# Altium schematic sheet mixer-rx.SchDoc: RX Mixer
size Letter; CheckedBy: J. Brinton; CompanyName: Signal Laboratories, Inc.; DrawnBy: J. Brinton; Engineer: J. Brinton; Address1: 3479 Edison Way; Address2: Menlo Park CA 94025; Address3: +1 (877) 778-8435; Address4: siglabs.com; Revision: 3; SheetNumber: 13; SheetTotal: 49
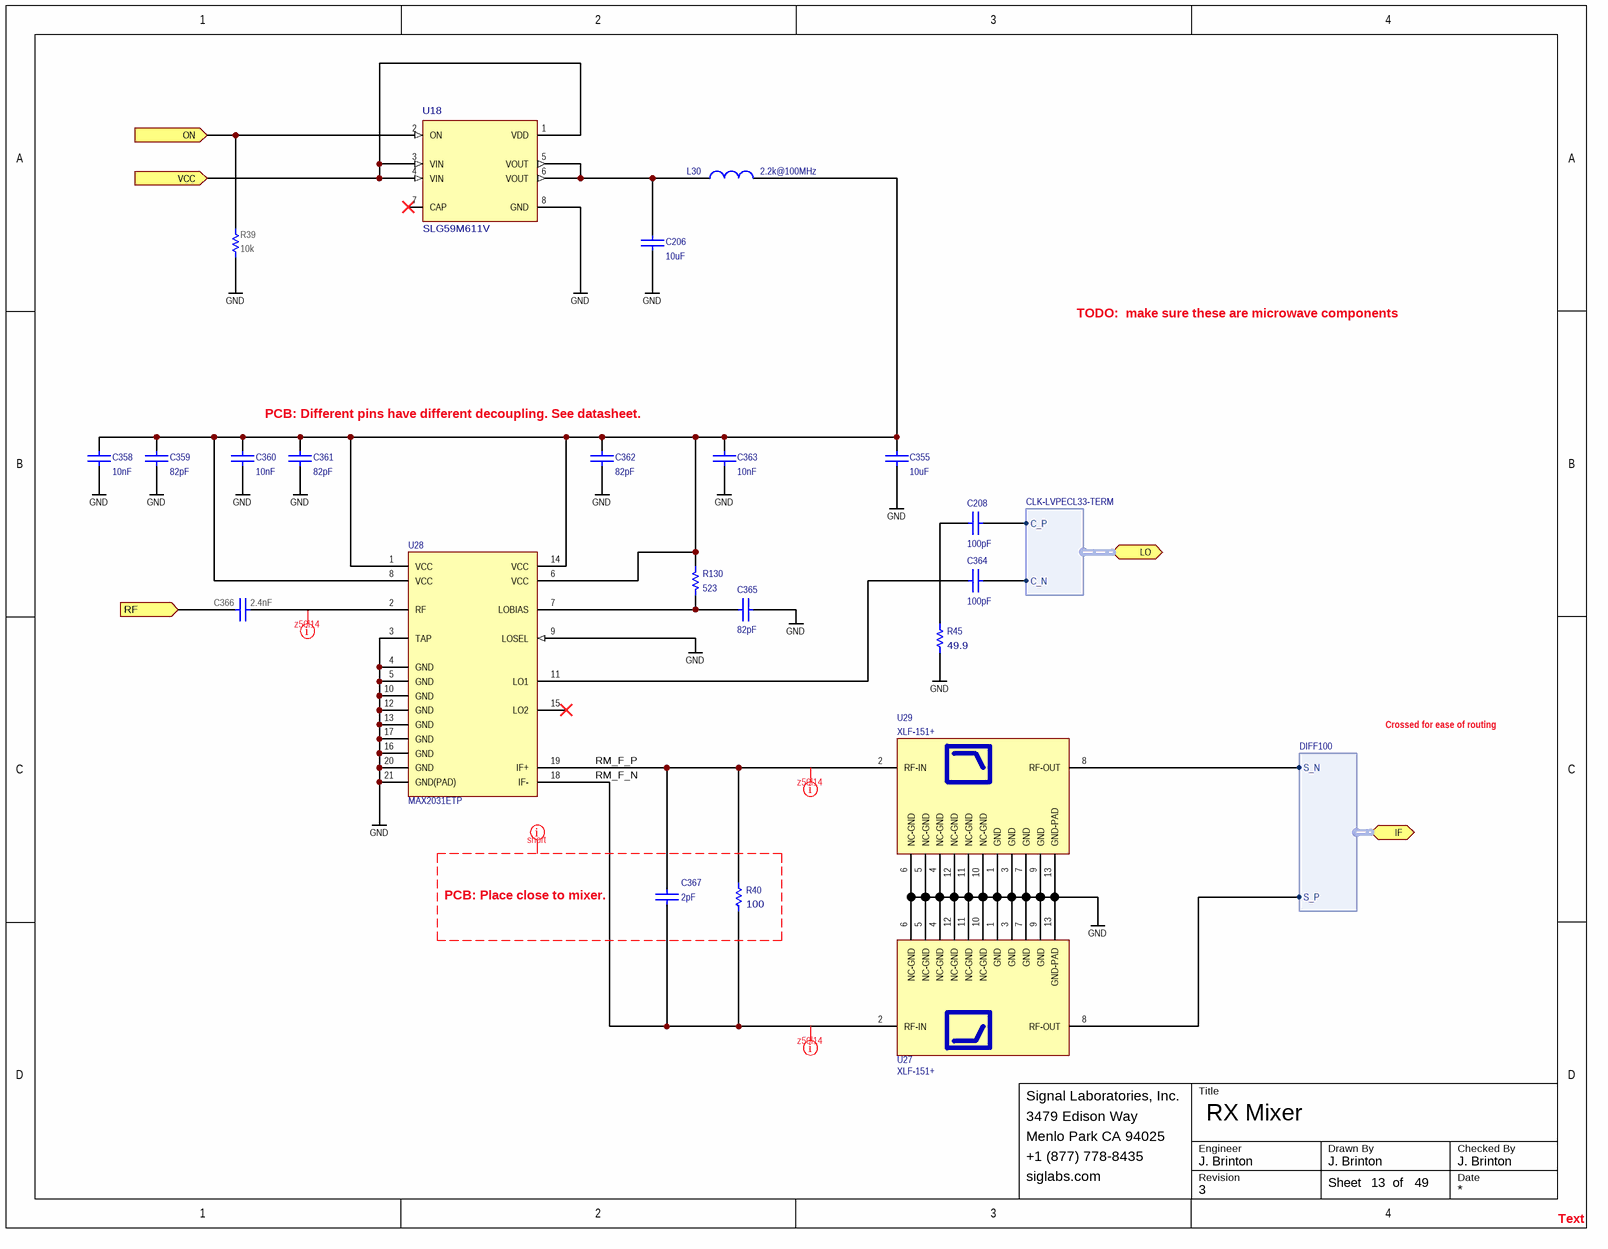
[diagram p0: mixer-rx.SchDoc]

## Parts
C206  value 10uF  [CAPC160X80X90L20N]  (hidden comment: ZRB18AR61E106ME01L)
C208  value 100pF  [CAPC100X50X55L25N]  (hidden comment: CBR04C101F3GAC)
C355  value 10uF  [CAPC160X80X90L20N]  (hidden comment: ZRB18AR61E106ME01L)
C358  value 10nF  [CAPC100X50X55L25N]  (hidden comment: GRM155R71H103KA88)
C359  value 82pF  [CAPC100X50X55L25N]  (hidden comment: VJ0402D820JXXAJ)
C360  value 10nF  [CAPC100X50X55L25N]  (hidden comment: GRM155R71H103KA88)
C361  value 82pF  [CAPC100X50X55L25N]  (hidden comment: VJ0402D820JXXAJ)
C362  value 82pF  [CAPC100X50X55L25N]  (hidden comment: VJ0402D820JXXAJ)
C363  value 10nF  [CAPC100X50X55L25N]  (hidden comment: GRM155R71H103KA88)
C364  value 100pF  [CAPC100X50X55L25N]  (hidden comment: CBR04C101F3GAC)
C365  value 82pF  [CAPC100X50X55L25N]  (hidden comment: VJ0402D820JXXAJ)
C366  value 2.4nF  [CAPC2012X145N]  (hidden comment: C08BL242X-5UN-X0T)
C367  value 2pF  [CAPC100X50X55L25N]  (hidden comment: GJM1555C1H2R0CB01D)
L30  value 2.2k@100MHz  [INDC1005X55N]  (hidden comment: MMZ1005A222ET000)
R39  value 10k  [RESC1005X40N]  (hidden comment: ERJ-2RKF1002X)
R40  value 100  [RESC1608X55N]  (hidden comment: MCT0603MD1000DP500)
R45  value 49.9  [RESC1608X55N]  (hidden comment: MCT0603PD4999DP500)
R130  value 523  [RESC1005X40N]  (hidden comment: ERA-2AEB5230X)
U18  SLG59M611V  [DFN200X150X80-8N]
U27  XLF-151+  [QFN-XLF-12]
U28  MAX2031ETP  [QFN21P65_500X500X80L55X30T320N]
U29  XLF-151+  [QFN-XLF-12]

## Ports
IF (harness DIFF100), LO (harness CLK-LVPECL33-TERM), ON (in), RF (in), VCC (in)

## Harnesses
CLK-LVPECL33-TERM: C_P, C_N
DIFF100: S_P, S_N

## Nets
GND: C206.1 C355.1 C358.1 C359.1 C360.1 C361.1 C362.1 C363.1 C365.2 R39.1 R45.1 U18.8(GND) U27.1(GND) U27.3(GND) U27.4(NC-GND) U27.5(NC-GND) U27.6(NC-GND) U27.7(GND) U27.9(GND) U27.10(NC-GND) U27.11(NC-GND) U27.12(NC-GND) U27.13(GND-PAD) U28.3(TAP) U28.4(GND) U28.5(GND) U28.9(LOSEL) U28.10(GND) U28.12(GND) U28.13(GND) U28.16(GND) U28.17(GND) U28.20(GND) U28.21(GND(PAD)) U29.1(GND) U29.3(GND) U29.4(NC-GND) U29.5(NC-GND) U29.6(NC-GND) U29.7(GND) U29.9(GND) U29.10(NC-GND) U29.11(NC-GND) U29.12(NC-GND) U29.13(GND-PAD)
ON: R39.2 U18.2(ON) ; port ON
RF: C366.2 ; port RF
RM_F_N: C367.1 R40.1 U27.2(RF-IN) U28.18(IF-)
RM_F_P: C367.2 R40.2 U28.19(IF+) U29.2(RF-IN)
VCC: U18.1(VDD) U18.3(VIN) U18.4(VIN) ; port VCC
NetC206_2: C206.2 L30.1 U18.5(VOUT) U18.6(VOUT)
NetC208_1: C208.1 R45.2
NetC208_2: C208.2 ; port LO.C_P
NetC355_2: C355.2 C358.2 C359.2 C360.2 C361.2 C362.2 C363.2 L30.2 R130.2 U28.1(VCC) U28.6(VCC) U28.8(VCC) U28.14(VCC)
NetC364_1: C364.1 U28.11(LO1)
NetC364_2: C364.2 ; port LO.C_N
NetC365_1: C365.1 R130.1 U28.7(LOBIAS)
NetC366_1: C366.1 U28.2(RF)
NetU27_8: U27.8(RF-OUT) ; port IF.S_P
NetU29_8: U29.8(RF-OUT) ; port IF.S_N

Not connected (* = marked no-connect by the designer): U18 7(CAP)*; U28 15(LO2)*

## Layout directives
net class z50l14: NetC366_1, RM_F_N, RM_F_P
net class short: (no net found under the mark)

## Notes on the sheet
- TODO:  make sure these are microwave components
- PCB: Different pins have different decoupling. See datasheet.
- Crossed for ease of routing
- (near C367) PCB: Place close to mixer.
- Text
- Title
- Engineer
- Revision
- Drawn By
- Checked By
- Date
- Sheet
- of

## Library data of the parts
C206 C355 = CAP 0603: Ceramic Capacitor 10uF ±20% 25V X5R 0603; Manufacturer: Murata; Tr: -55:85; Manufacturer P/N: ZRB18AR61E106ME01L; Voltage: 25V; Package: 0603; Tolerance: ±20%
C208 C364 = CAP 0603: Ceramic Capacitor 100pF ±1% 25V NP0 0402; Manufacturer: Kemet; Tr: -55:125; Voltage: 25V; Manufacturer P/N: CBR04C101F3GAC; Package: 0402; Tolerance: ±1%
C358 C360 C363 = CAP 0402: Ceramic Capacitor 10nF ±10% 50V X7R 0402; Manufacturer: Murata; Tr: -55:125; Voltage: 50V; Manufacturer P/N: GRM155R71H103KA88; Package: 0402; Tolerance: ±10%
C359 C361 C362 C365 = CAP: Ceramic Capacitor 82pF ±5% 25V NP0 0402; Manufacturer: Vishay; Tr: 55:125; Manufacturer P/N: VJ0402D820JXXAJ; Voltage: 25V; Tolerance: ±5%; Footprint: *; Package: 0402
C366 = CAP: Ceramic Capacitor 2.4nF 50V 0805; Manufacturer: Dielectric Laboratories; Tr: -55:105; Manufacturer P/N: C08BL242X-5UN-X0T; Voltage: 50V; Package: 0805
C367 = CAP 0402: Ceramic Capacitor 2pF ±0.25pF 50V NP0 0402; Manufacturer: Murata; Tr: -55:125; Voltage: 50V; Manufacturer P/N: GJM1555C1H2R0CB01D; Package: 0402; Tolerance: ±0.25pF
L30 = INDUCTANCE1: Ferrite Bead 2.2k@100MHz 150mA 0402; Manufacturer: TDK; Tr: -55:125; Manufacturer P/N: MMZ1005A222ET000; Package: 0402
R39 = RES: Thick Film Resistor 10k ±1% 0.1W 50V 0402; Manufacturer: Panasonic; Tcr: ±100; Tr: -55:155; Voltage: 50; Power: 0.1; Manufacturer P/N: ERJ-2RKF1002X; Tolerance: ±1%; Alternatives: *; Footprint: *; Package: 0402
R40 = RES 0603: Thin Film Resistor 100 Ohm ±0.5% 0603; Manufacturer: Vishay; Tr: -55:175; Package: 0603; Manufacturer P/N: MCT0603MD1000DP500; Do Not Place: *; Tolerance: ±0.5%
R45 = RES 0603: Thin Film Resistor 49.9 Ohm ±0.5% 0603; Manufacturer: Vishay; Tr: -55:155; Package: 0603; Manufacturer P/N: MCT0603PD4999DP500; Do Not Place: *; Tolerance: ±0.5%
R130 = RES 0402: Thin Film Resistor 523 ±0.1% 0402; Manufacturer: Panasonic; Tr: -55:155; Package: 0402; Manufacturer P/N: ERA-2AEB5230X; Tolerance: ±0.1%
U18 = SLG59M611V: High-Side Load Switch; Manufacturer: Silego; Package: WFDFN-8 Silego; Manufacturer P/N: SLG59M611V
U27 U29 = XLF-151+: Reflectionless Low-Pass Filter, DC-150Mhz; Manufacturer: Mini-Circuits; Manufacturer P/N: XLF-151+
U28 = MAX2031ETP: Upconversion/Downconversion Mixer; Manufacturer: Maxim; Manufacturer P/N: MAX2031ETP